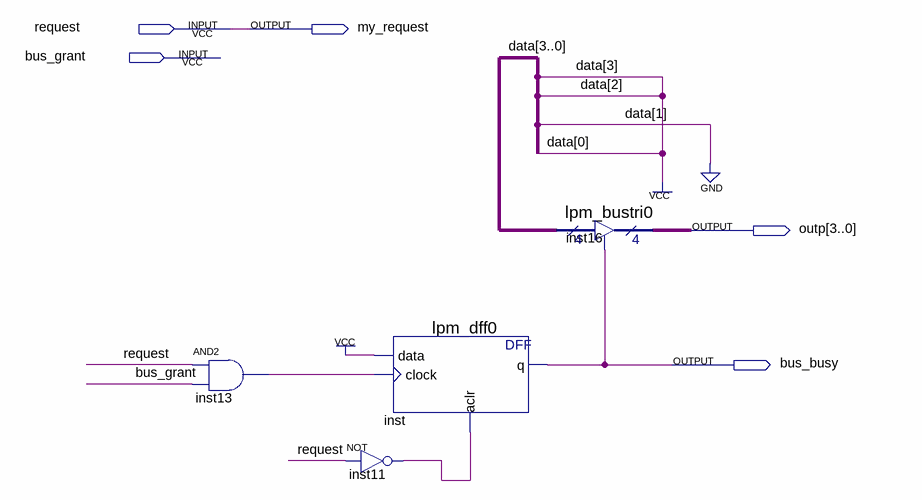
[diagram p0: schematic sheet]
// Quartus schematic device4.bdf as structural Verilog: 4 symbols, 5 pins
module device4 (
  input  request,
  input  bus_grant,
  output my_request,
  output [3:0] outp,
  output bus_busy
);

  wire inst11_out, inst13_out;

  and inst13 (inst13_out, request, bus_grant);
  lpm_dff0 inst (.data(1'b1), .clock(inst13_out), .aclr(inst11_out), .q(bus_busy));
  not inst11 (inst11_out, request);
  lpm_bustri0 inst16 (.enabledt(bus_busy), .data(4'b1101), .tridata(outp));

  assign my_request = request;
endmodule
